# Altium schematic sheet LCD12864_COG_FPC_32P_0.8mm_SCH.SchDoc
size A4
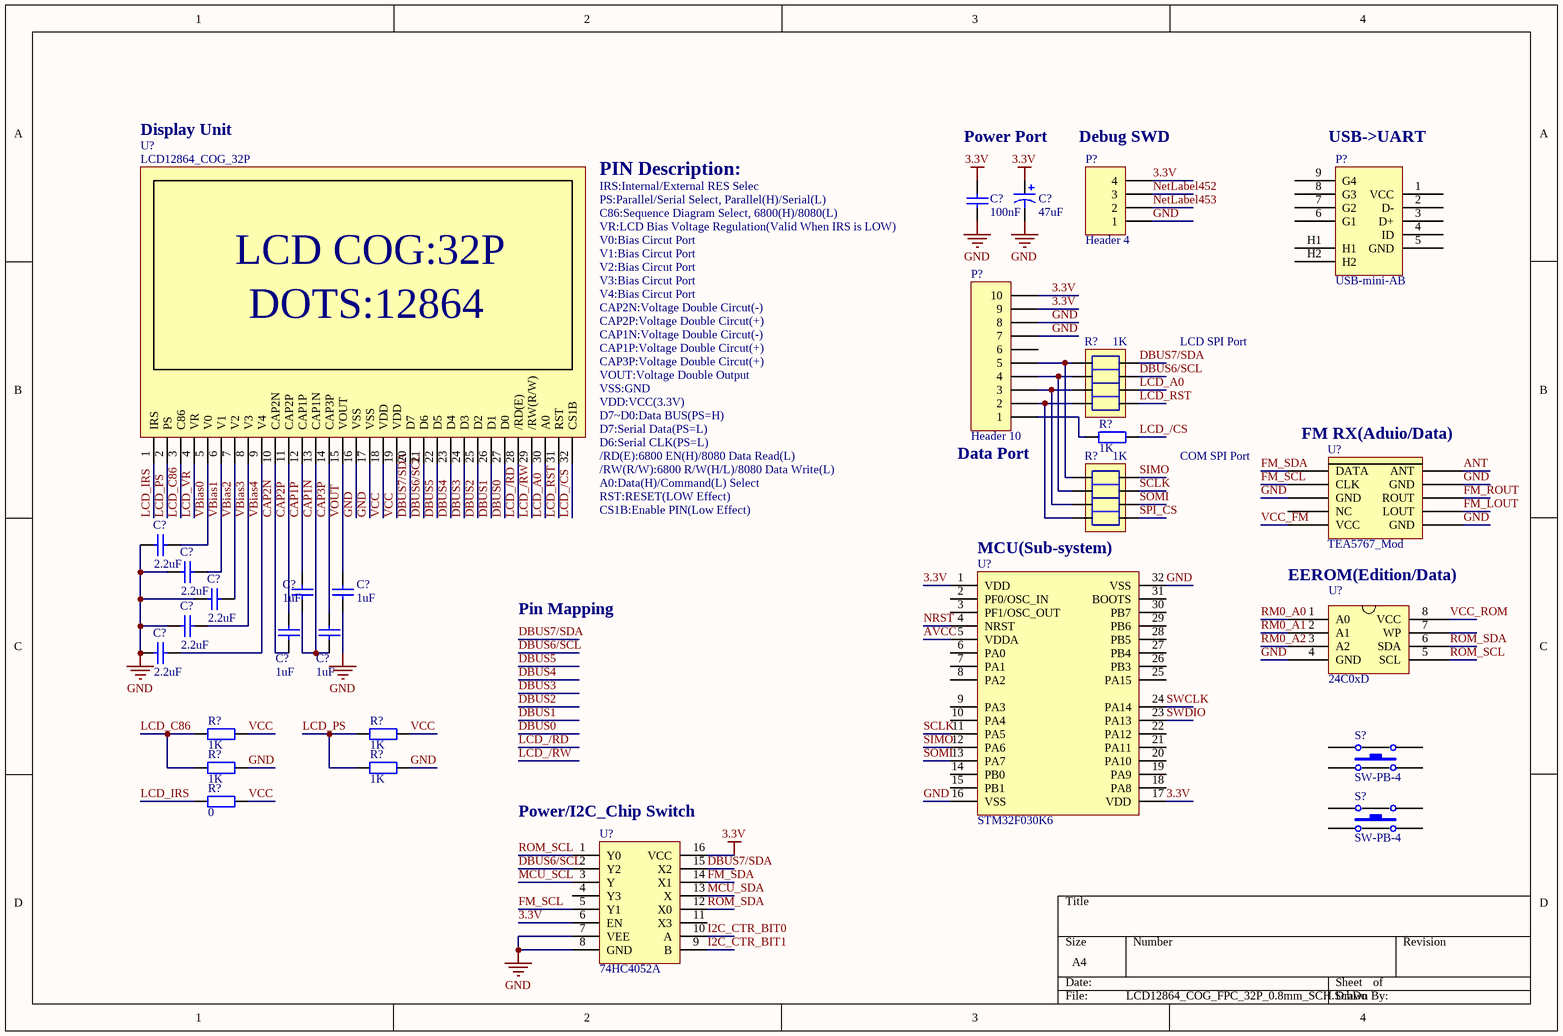
[diagram p0: LCD12864_COG_FPC_32P_0.8mm_SCH.SchDoc]

## Parts
(Parts that share a designator on the sheet are numbered #1, #2 ... from top to bottom, then left to right.)
C?#1  value 100nF  [0603]  (hidden comment: Cap)
C?#2  value 47uF  [1210]  (hidden comment: Cap Pol1)
C?#3  value 2.2uF  [0805]  (hidden comment: Cap)
C?#4  value 2.2uF  [0805]  (hidden comment: Cap)
C?#5  value 2.2uF  [0805]  (hidden comment: Cap)
C?#6  value 1uF  [0805]  (hidden comment: Cap)
C?#7  value 1uF  [0805]  (hidden comment: Cap)
C?#8  value 2.2uF  [0805]  (hidden comment: Cap)
C?#9  value 1uF  [0805]  (hidden comment: Cap)
C?#10  value 1uF  [0805]  (hidden comment: Cap)
C?#11  value 2.2uF  [0805]  (hidden comment: Cap)
P?#1  USB-mini-AB  [USBmini]
P?#2  Header 4  [HDR1X4]
P?#3  Header 10  [HDR1X10]
R?#1  value 1K  [8P4R_0603]  (hidden comment: Res_Pack)
R?#2  value 1K  [0603]  (hidden comment: Res2)
R?#3  value 1K  [8P4R_0603]  (hidden comment: Res_Pack)
R?#4  value 1K  [0603]  (hidden comment: Res2)
R?#5  value 1K  [0603]  (hidden comment: Res2)
R?#6  value 1K  [0603]  (hidden comment: Res2)
R?#7  value 1K  [0603]  (hidden comment: Res2)
R?#8  value 0  [0603]  (hidden comment: Res2)
S?#1  SW-PB-4  [SW_PB_4]
S?#2  SW-PB-4  [SW_PB_4]
U?#1  LCD12864_COG_32P
U?#2  TEA5767_Mod
U?#3  STM32F030K6  [TQFP32]
U?#4  24C0xD
U?#5  74HC4052A  [SO16]

## Nets
3.3V: C?#1.1 C?#2.1 P?#2.4 P?#3.9 P?#3.10 U?#3.1(VDD) U?#3.17(VDD) U?#5.6(EN) U?#5.16(VCC)
GND: C?#1.2 C?#2.2 C?#3.1 C?#4.1 C?#5.1 C?#7.2 C?#8.1 C?#11.1 P?#2.1 P?#3.7 P?#3.8 R?#6.2 R?#7.2 U?#1.16(VSS) U?#1.17(VSS) U?#2.3(GND) U?#2.6(GND) U?#2.9(GND) U?#3.16(VSS) U?#3.32(VSS) U?#4.4(GND) U?#5.7(VEE) U?#5.8(GND)
ANT: U?#2.10(ANT)
AVCC: U?#3.5(VDDA)
CAP1N: C?#6.2 C?#10.2 U?#1.13(CAP1N)
CAP1P: C?#6.1 U?#1.12(CAP1P)
CAP2N: C?#9.2 U?#1.10(CAP2N)
CAP2P: C?#9.1 U?#1.11(CAP2P)
CAP3P: C?#10.1 U?#1.14(CAP3P)
DBUS0: U?#1.27(D0)
DBUS1: U?#1.26(D1)
DBUS2: U?#1.25(D2)
DBUS3: U?#1.24(D3)
DBUS4: U?#1.23(D4)
DBUS5: U?#1.22(D5)
DBUS6/SCL: R?#1.3 U?#1.21(D6) U?#5.2(Y2)
DBUS7/SDA: R?#1.4 U?#1.20(D7) U?#5.15(X2)
FM_LOUT: U?#2.7(LOUT)
FM_ROUT: U?#2.8(ROUT)
FM_SCL: U?#2.2(CLK) U?#5.5(Y1)
FM_SDA: U?#2.1(DATA) U?#5.14(X1)
I2C_CTR_BIT0: U?#5.10(A)
I2C_CTR_BIT1: U?#5.9(B)
LCD_/CS: R?#2.2 U?#1.32(CS1B)
LCD_/RD: U?#1.28(/RD(E))
LCD_/RW: U?#1.29(/RW(R/W))
LCD_A0: R?#1.2 U?#1.30(A0)
LCD_C86: R?#4.1 R?#6.1 U?#1.3(C86)
LCD_IRS: R?#8.1 U?#1.1(IRS)
LCD_PS: R?#5.1 R?#7.1 U?#1.2(PS)
LCD_RST: R?#1.1 U?#1.31(RST)
LCD_VR: U?#1.4(VR)
MCU_SCL: U?#5.3(Y)
MCU_SDA: U?#5.13(X)
NetLabel452: P?#2.3
NetLabel453: P?#2.2
NRST: U?#3.4(NRST)
RM0_A0: U?#4.1(A0)
RM0_A1: U?#4.2(A1)
RM0_A2: U?#4.3(A2)
ROM_SCL: U?#4.5(SCL) U?#5.1(Y0)
ROM_SDA: U?#4.6(SDA) U?#5.12(X0)
SCLK: R?#3.3 U?#3.11(PA5)
SIMO: R?#3.4 U?#3.12(PA6)
SOMI: R?#3.2 U?#3.13(PA7)
SPI_CS: R?#3.1
SWCLK: U?#3.24(PA14)
SWDIO: U?#3.23(PA13)
VBias0: C?#3.2 U?#1.5(V0)
VBias1: C?#4.2 U?#1.6(V1)
VBias2: C?#5.2 U?#1.7(V2)
VBias3: C?#8.2 U?#1.8(V3)
VBias4: C?#11.2 U?#1.9(V4)
VCC: R?#4.2 R?#5.2 R?#8.2 U?#1.18(VDD) U?#1.19(VDD)
VCC_FM: U?#2.5(VCC)
VCC_ROM: U?#4.8(VCC)
VOUT: C?#7.1 U?#1.15(VOUT)
NetP?#3_1: P?#3.1 R?#2.1
NetP?#3_2: P?#3.2 R?#1.8 R?#3.8
NetP?#3_3: P?#3.3 R?#1.7 R?#3.7
NetP?#3_4: P?#3.4 R?#1.6 R?#3.6
NetP?#3_5: P?#3.5 R?#1.5 R?#3.5

Not connected (* = marked no-connect by the designer): P?#1 1(VCC) 2(D-) 3(D+) 4(ID) 5(GND) 6(G1) 7(G2) 8(G3) 9(G4) H1 H2; P?#3 6; S?#1 1 2 3 4; S?#2 1 2 3 4; U?#2 4(NC); U?#3 2(PF0/OSC_IN) 3(PF1/OSC_OUT) 6(PA0) 7(PA1) 8(PA2) 9(PA3) 10(PA4) 14(PB0) 15(PB1) 18(PA8) 19(PA9) 20(PA10) 21(PA11) 22(PA12) 25(PA15) 26(PB3) 27(PB4) 28(PB5) 29(PB6) 30(PB7) 31(BOOTS); U?#4 7(WP); U?#5 4(Y3) 11(X3)

## Notes on the sheet
- Display Unit
- PIN Description:
- (near C?#1) Power Port
- (near P?#2) Debug SWD
- (near P?#1) USB->UART
- IRS:Internal/External RES Selec
- PS:Parallel/Serial Select, Parallel(H)/Serial(L)
- C86:Sequence Diagram Select, 6800(H)/8080(L)
- VR:LCD Bias Voltage Regulation(Valid When IRS is LOW)
- V0:Bias Circut Port
- V1:Bias Circut Port
- V2:Bias Circut Port
- V3:Bias Circut Port
- V4:Bias Circut Port
- CAP2N:Voltage Double Circut(-)
- CAP2P:Voltage Double Circut(+)
- CAP1N:Voltage Double Circut(-)
- CAP1P:Voltage Double Circut(+)
- CAP3P:Voltage Double Circut(+)
- VOUT:Voltage Double Output
- LCD SPI Port
- (near U?#1) VSS:GND
- (near U?#1) VDD:VCC(3.3V)
- (near U?#1) D7~D0:Data BUS(PS=H)
- (near U?#1) D7:Serial Data(PS=L)
- (near U?#1) D6:Serial CLK(PS=L)
- (near U?#2) FM RX(Aduio/Data)
- (near U?#1) /RD(E):6800 EN(H)/8080 Data Read(L)
- (near U?#1) /RW(R/W):6800 R/W(H/L)/8080 Data Write(L)
- (near U?#1) A0:Data(H)/Command(L) Select
- RST:RESET(LOW Effect)
- CS1B:Enable PIN(Low Effect)
- (near P?#3) Data Port
- COM SPI Port
- MCU(Sub-system)
- (near U?#4) EEROM(Edition/Data)
- Pin Mapping
- (near U?#5) Power/I2C_Chip Switch
- (in symbol LCD12864_COG_32P_SCREEN) LCD COG:32P; DOTS:12864

## Library data of the parts
C?#1 C?#3-C?#11 = Cap: Capacitor; Published: 8-Jun-2000; LatestRevisionDate: 17-Jul-2002; LatestRevisionNote: Re-released for DXP Platform.; PackageReference: RAD-0.3; Publisher: Altium Limited; PackageDescription: Radial Cap, Thru-Hole; 2 Leads; 0.3 in Pin Spacing
C?#2 = Cap Pol1: Polarized Capacitor (Radial); Published: 8-Jun-2000; LatestRevisionDate: 17-Jul-2002; LatestRevisionNote: Re-released for DXP Platform.; PackageReference: RB7.6-15; Publisher: Altium Limited; PackageDescription: Polarized Capacitor (Radial); 2 Leads
P?#2 = Header 4: Header, 4-Pin; LatestRevisionDate: 17-Jul-2002; LatestRevisionNote: Re-released for DXP Platform.; Publisher: Altium Limited
P?#3 = Header 10: Header, 10-Pin; LatestRevisionDate: 17-Jul-2002; LatestRevisionNote: Re-released for DXP Platform.; Publisher: Altium Limited
R?#1 R?#3 = Res_Pack_4: resistor
R?#2 R?#4-R?#8 = Res2: Resistor; Published: 8-Jun-2000; LatestRevisionDate: 17-Jul-2002; LatestRevisionNote: Re-released for DXP Platform.; PackageReference: AXIAL-0.4; Publisher: Altium Limited; PackageDescription: Axial Device, Thru-Hole; 2 Leads; 0.4 in Pin Spacing
S?#1 S?#2 = SW-PB
U?#1 = LCD12864_COG_32P_SCREEN: LCD12864 COG 32PIN SCREEN
U?#2 = TEA5767_Model: A FM Receiver Block by TEA5767
U?#4 = 24C01D/02D_8PIN: EEPROM with I2C BUS
U?#5 = 74HC4052A: 74HC4052A is a common use analog switch.